# EAGLE design M222B (EAGLE 6.6.0)
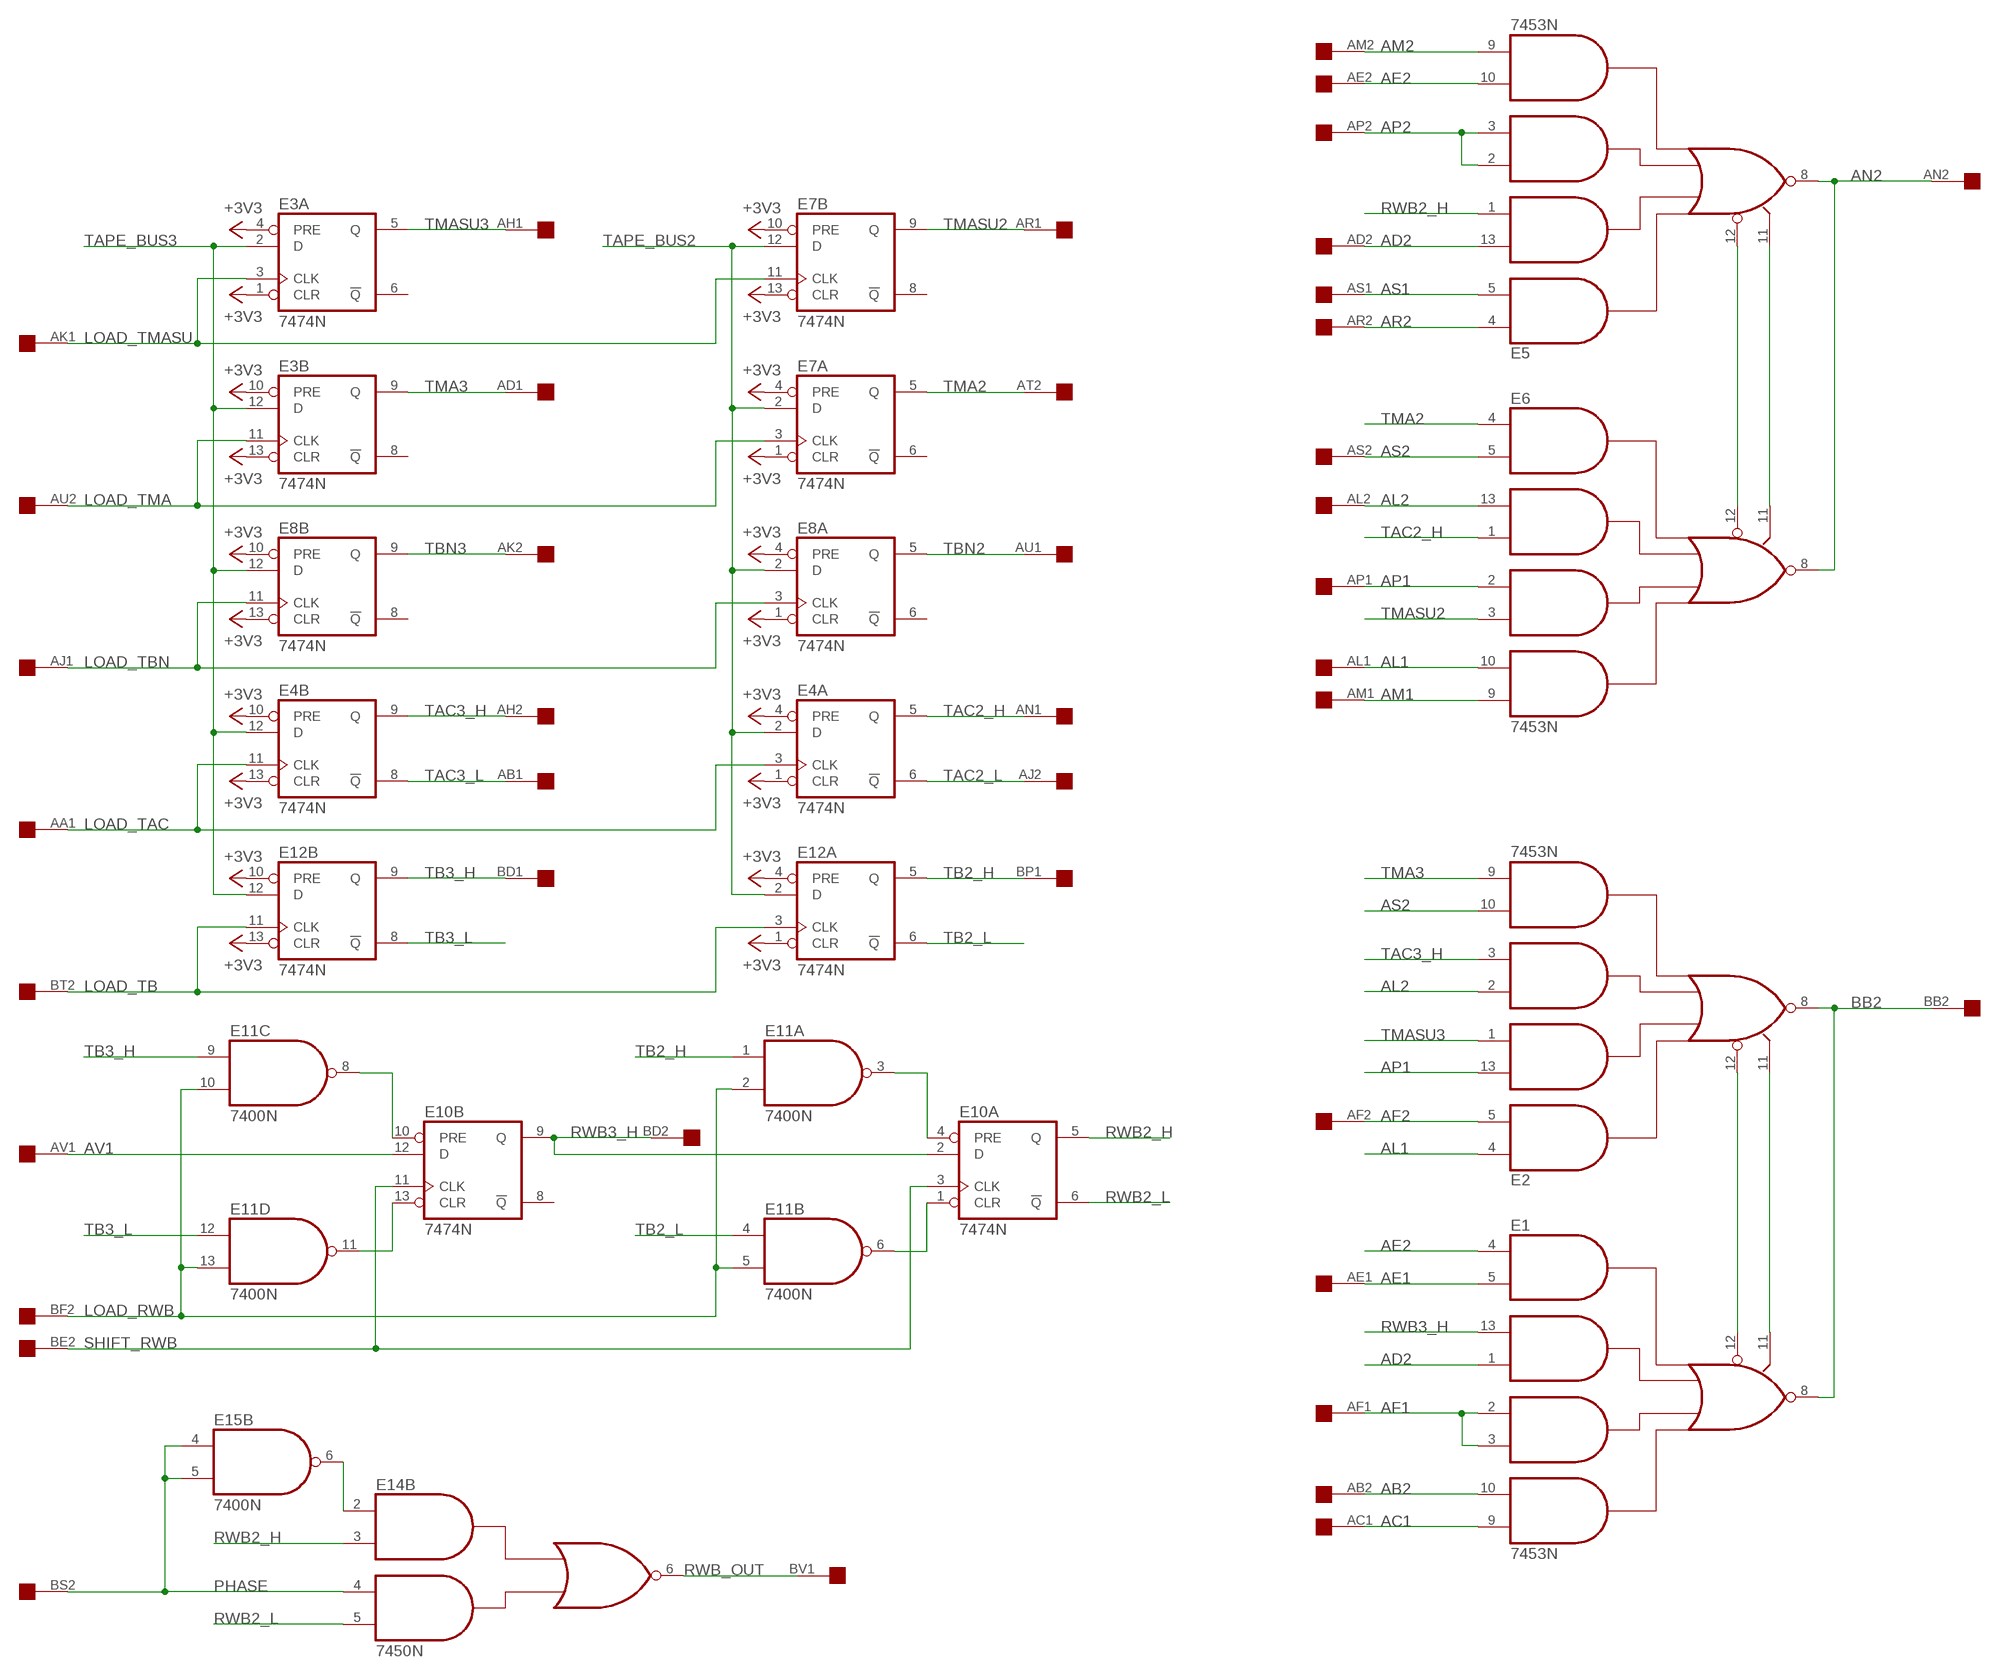
[diagram p0: schematic, sheet 1, part 1 of 2]
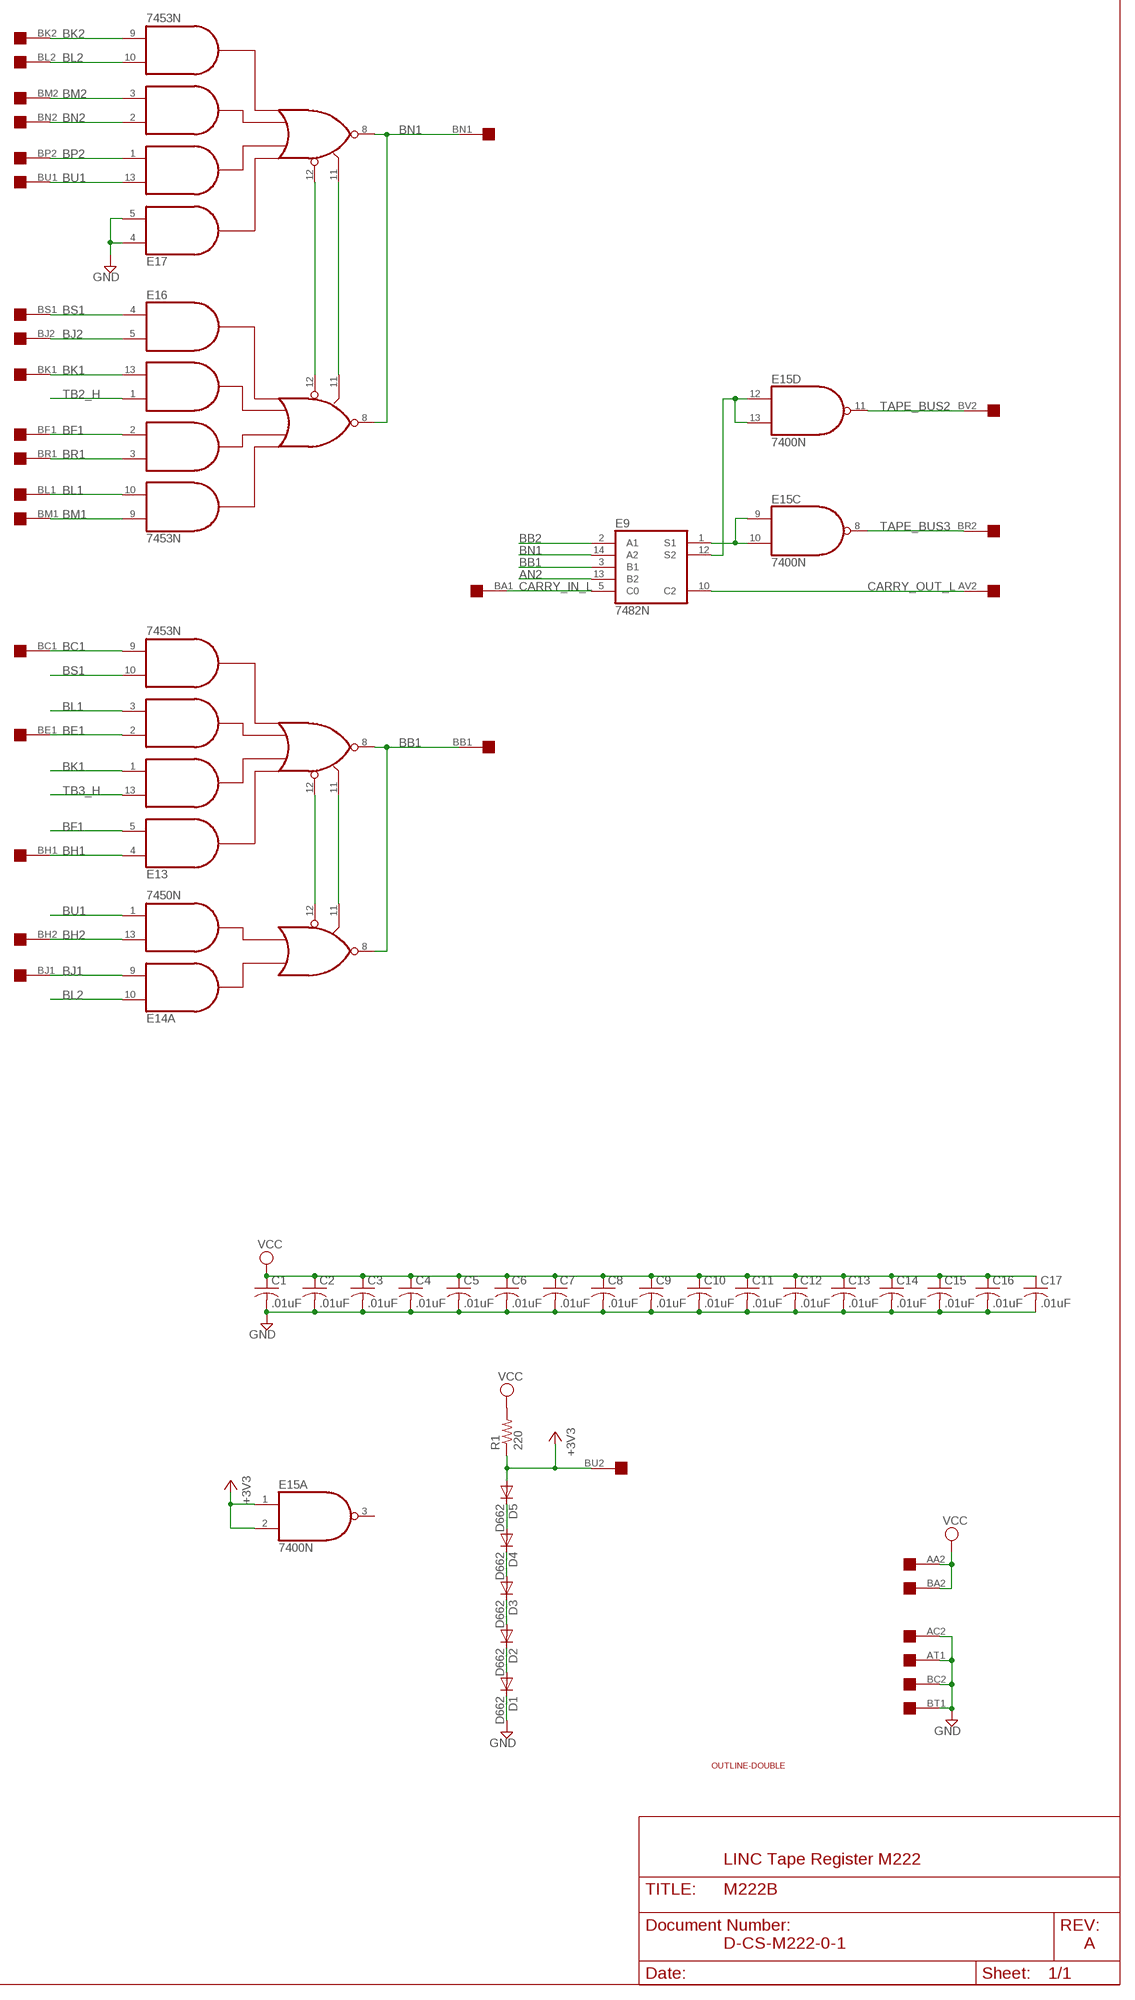
[diagram p1: schematic, sheet 1, part 2 of 2]

## Parts
C1  .01uF  C-US050-025X075  [C050-025X075]
C2  .01uF  C-US050-025X075  [C050-025X075]
C3  .01uF  C-US050-025X075  [C050-025X075]
C4  .01uF  C-US050-025X075  [C050-025X075]
C5  .01uF  C-US050-025X075  [C050-025X075]
C6  .01uF  C-US050-025X075  [C050-025X075]
C7  .01uF  C-US050-025X075  [C050-025X075]
C8  .01uF  C-US050-025X075  [C050-025X075]
C9  .01uF  C-US050-025X075  [C050-025X075]
C10  .01uF  C-US050-025X075  [C050-025X075]
C11  .01uF  C-US050-025X075  [C050-025X075]
C12  .01uF  C-US050-025X075  [C050-025X075]
C13  .01uF  C-US050-025X075  [C050-025X075]
C14  .01uF  C-US050-025X075  [C050-025X075]
C15  .01uF  C-US050-025X075  [C050-025X075]
C16  .01uF  C-US050-025X075  [C050-025X075]
C17  .01uF  C-US050-025X075  [C050-025X075]
D1  D662  1N4148DO35-10  [DO35-10]
D2  D662  1N4148DO35-10  [DO35-10]
D3  D662  1N4148DO35-10  [DO35-10]
D4  D662  1N4148DO35-10  [DO35-10]
D5  D662  1N4148DO35-10  [DO35-10]
E1  7453N  [DIL14]
E2  7453N  [DIL14]
E3  7474N  74S74N  [DIL14]
E4  7474N  74S74N  [DIL14]
E5  7453N  [DIL14]
E6  7453N  [DIL14]
E7  7474N  74S74N  [DIL14]
E8  7474N  74S74N  [DIL14]
E9  7482N  [DIL14]
E10  7474N  74S74N  [DIL14]
E11  7400N  [DIL14]
E12  7474N  74S74N  [DIL14]
E13  7453N  [DIL14]
E14  7450N  [DIL14]
E15  7400N  [DIL14]
E16  7453N  [DIL14]
E17  7453N  [DIL14]
R1  220  R-US_0207/10  [0207/10]
U$1  DOUBLE  [EDGE-CON4]
U$2  OUTLINE-DOUBLE  [DOUBLE]

## Nets
+3V3 [Supply]: D5.A E3.1(A:CLR) E3.4(A:PRE) E3.10(B:PRE) E3.13(B:CLR) E4.1(A:CLR) E4.4(A:PRE) E4.10(B:PRE) E4.13(B:CLR) E7.1(A:CLR) E7.4(A:PRE) E7.10(B:PRE) E7.13(B:CLR) E8.1(A:CLR) E8.4(A:PRE) E8.10(B:PRE) E8.13(B:CLR) E12.1(A:CLR) E12.4(A:PRE) E12.10(B:PRE) E12.13(B:CLR) E15.1(A:I0) E15.2(A:I1) R1.1 U$1.BU2
AB2: E1.10(I7) U$1.AB2
AC1: E1.9(I8) U$1.AC1
AD2: E1.1(I4) E5.13(I3) U$1.AD2
AE1: E1.5(I2) U$1.AE1
AE2: E1.4(I1) E5.10(I7) U$1.AE2
AF1: E1.2(I5) E1.3(I6) U$1.AF1
AF2: E2.5(I2) U$1.AF2
AL1: E2.4(I1) E6.10(I7) U$1.AL1
AL2: E2.2(I5) E6.13(I3) U$1.AL2
AM1: E6.9(I8) U$1.AM1
AM2: E5.9(I8) U$1.AM2
AN2: E5.8(O) E6.8(O) E9.13(B2) U$1.AN2
AP1: E2.13(I3) E6.2(I5) U$1.AP1
AP2: E5.2(I5) E5.3(I6) U$1.AP2
AR2: E5.4(I1) U$1.AR2
AS1: E5.5(I2) U$1.AS1
AS2: E2.10(I7) E6.5(I2) U$1.AS2
AV1: E10.12(B:D) U$1.AV1
BB1: E9.3(B1) E13.8(O) E14.8(A:O) U$1.BB1
BB2: E1.8(O) E2.8(O) E9.2(A1) U$1.BB2
BC1: E13.9(I8) U$1.BC1
BE1: E13.2(I5) U$1.BE1
BF1: E13.5(I2) E16.2(I5) U$1.BF1
BH1: E13.4(I1) U$1.BH1
BH2: E14.13(A:I3) U$1.BH2
BJ1: E14.9(A:I2) U$1.BJ1
BJ2: E16.5(I2) U$1.BJ2
BK1: E13.1(I4) E16.13(I3) U$1.BK1
BK2: E17.9(I8) U$1.BK2
BL1: E13.3(I6) E16.10(I7) U$1.BL1
BL2: E14.10(A:I1) E17.10(I7) U$1.BL2
BM1: E16.9(I8) U$1.BM1
BM2: E17.3(I6) U$1.BM2
BN1: E9.14(A2) E16.8(O) E17.8(O) U$1.BN1
BN2: E17.2(I5) U$1.BN2
BP2: E17.1(I4) U$1.BP2
BR1: E16.3(I6) U$1.BR1
BS1: E13.10(I7) E16.4(I1) U$1.BS1
BU1: E14.1(A:I4) E17.13(I3) U$1.BU1
CARRY_IN_L: E9.5(C0) U$1.BA1
CARRY_OUT_L: E9.10(C2) U$1.AV2
GND [Supply]: C1.2 C2.2 C3.2 C4.2 C5.2 C6.2 C7.2 C8.2 C9.2 C10.2 C11.2 C12.2 C13.2 C14.2 C15.2 C16.2 C17.2 D1.C E17.4(I1) E17.5(I2) U$1.AC2 U$1.AT1 U$1.BC2 U$1.BT1
LOAD_RWB: E11.2(A:I1) E11.5(B:I1) E11.10(C:I1) E11.13(D:I1) U$1.BF2
LOAD_TAC: E4.3(A:CLK) E4.11(B:CLK) U$1.AA1
LOAD_TB: E12.3(A:CLK) E12.11(B:CLK) U$1.BT2
LOAD_TBN: E8.3(A:CLK) E8.11(B:CLK) U$1.AJ1
LOAD_TMA: E3.11(B:CLK) E7.3(A:CLK) U$1.AU2
LOAD_TMASU: E3.3(A:CLK) E7.11(B:CLK) U$1.AK1
N$1: E9.1(S1) E15.9(C:I0) E15.10(C:I1)
N$2: E9.12(S2) E15.12(D:I0) E15.13(D:I1)
N$3: E1.12(I9) E2.12(I9)
N$4: E1.11(I10) E2.11(I10)
N$5: E5.11(I10) E6.11(I10)
N$6: E5.12(I9) E6.12(I9)
N$7: E10.13(B:CLR) E11.11(D:O)
N$8: E10.10(B:PRE) E11.8(C:O)
N$9: E16.12(I9) E17.12(I9)
N$10: E16.11(I10) E17.11(I10)
N$11: D4.A D5.C
N$12: E13.12(I9) E14.12(A:I5)
N$13: E13.11(I10) E14.11(A:I6)
N$14: D1.A D2.C
N$15: E14.2(B:I1) E15.6(B:O)
N$16: E10.4(A:PRE) E11.3(A:O)
N$17: E10.1(A:CLR) E11.6(B:O)
N$18: D2.A D3.C
N$19: D3.A D4.C
PHASE: E14.4(B:I3) E15.4(B:I0) E15.5(B:I1) U$1.BS2
RWB2_H: E5.1(I4) E10.5(A:Q) E14.3(B:I2)
RWB2_L: E10.6(A:!Q) E14.5(B:I4)
RWB3_H: E1.13(I3) E10.2(A:D) E10.9(B:Q) U$1.BD2
RWB_OUT: E14.6(B:O) U$1.BV1
SHIFT_RWB: E10.3(A:CLK) E10.11(B:CLK) U$1.BE2
TAC2_H: E4.5(A:Q) E6.1(I4) U$1.AN1
TAC2_L: E4.6(A:!Q) U$1.AJ2
TAC3_H: E2.3(I6) E4.9(B:Q) U$1.AH2
TAC3_L: E4.8(B:!Q) U$1.AB1
TAPE_BUS2: E4.2(A:D) E7.2(A:D) E7.12(B:D) E8.2(A:D) E12.2(A:D) E15.11(D:O) U$1.BV2
TAPE_BUS3: E3.2(A:D) E3.12(B:D) E4.12(B:D) E8.12(B:D) E12.12(B:D) E15.8(C:O) U$1.BR2
TB2_H: E11.1(A:I0) E12.5(A:Q) E16.1(I4) U$1.BP1
TB2_L: E11.4(B:I0) E12.6(A:!Q)
TB3_H: E11.9(C:I0) E12.9(B:Q) E13.13(I3) U$1.BD1
TB3_L: E11.12(D:I0) E12.8(B:!Q)
TBN2: E8.5(A:Q) U$1.AU1
TBN3: E8.9(B:Q) U$1.AK2
TMA2: E6.4(I1) E7.5(A:Q) U$1.AT2
TMA3: E2.9(I8) E3.9(B:Q) U$1.AD1
TMASU2: E6.3(I6) E7.9(B:Q) U$1.AR1
TMASU3: E2.1(I4) E3.5(A:Q) U$1.AH1
VCC [Supply]: C1.1 C2.1 C3.1 C4.1 C5.1 C6.1 C7.1 C8.1 C9.1 C10.1 C11.1 C12.1 C13.1 C14.1 C15.1 C16.1 C17.1 R1.2 U$1.AA2 U$1.BA2
Unconnected: E1.6(SPARE) E2.6(SPARE) E3.6(A:!Q) E3.8(B:!Q) E5.6(SPARE) E6.6(SPARE) E7.6(A:!Q) E7.8(B:!Q) E8.6(A:!Q) E8.8(B:!Q) E9.6 E9.7 E9.8 E9.9 E10.8(B:!Q) E13.6(SPARE) E15.3(A:O) E16.6(SPARE) E17.6(SPARE)

## Notes on the sheet
- LINC Tape Register M222
- D-CS-M222-0-1 | A

## Power pins joined to a net without a drawn wire
GND: E1.7(GND) E2.7(GND) E3.7(P:GND) E4.7(P:GND) E5.7(GND) E6.7(GND) E7.7(P:GND) E8.7(P:GND) E9.11(GND) E10.7(P:GND) E11.7(P:GND) E12.7(P:GND) E13.7(GND) E14.7(P:GND) E15.7(P:GND) E16.7(GND) E17.7(GND)
VCC: E1.14(VCC) E2.14(VCC) E3.14(P:VCC) E4.14(P:VCC) E5.14(VCC) E6.14(VCC) E7.14(P:VCC) E8.14(P:VCC) E9.4(VCC) E10.14(P:VCC) E11.14(P:VCC) E12.14(P:VCC) E13.14(VCC) E14.14(P:VCC) E15.14(P:VCC) E16.14(VCC) E17.14(VCC)

## Library data of the parts
C1-C17 = rcl:C-US: CAPACITOR, American symbol
D1-D5 = diode:1N4148: DIODE high speed (Philips)
E1 E2 E5 E6 E13 E16 E17 = dec-con:74*53: 4-2-3-2 input AND OR INVERTER gates
E3 E4 E7 E8 E10 E12 = 74xx-us:74*74: Dual D type positive edge triggered FLIP FLOP, preset and clear
E9 = dec-con:74*82: 2-bit binary full ADDER Has the wrong GND pin in other libraries.
E11 E15 = 74xx-us:74*00: Quad 2-input NAND gate
E14 = dec-con:74*50: 4-2-3-2 input AND OR INVERTER gates
R1 = rcl:R-US_: RESISTOR, American symbol
U$1 = dec-con:DOUBLE: Double-Height DEC board
U$2 = dec-con:OUTLINE-*: Board outlines for DEC boards.

## Net classes
1 Supply: width 0.813 mm

## Board
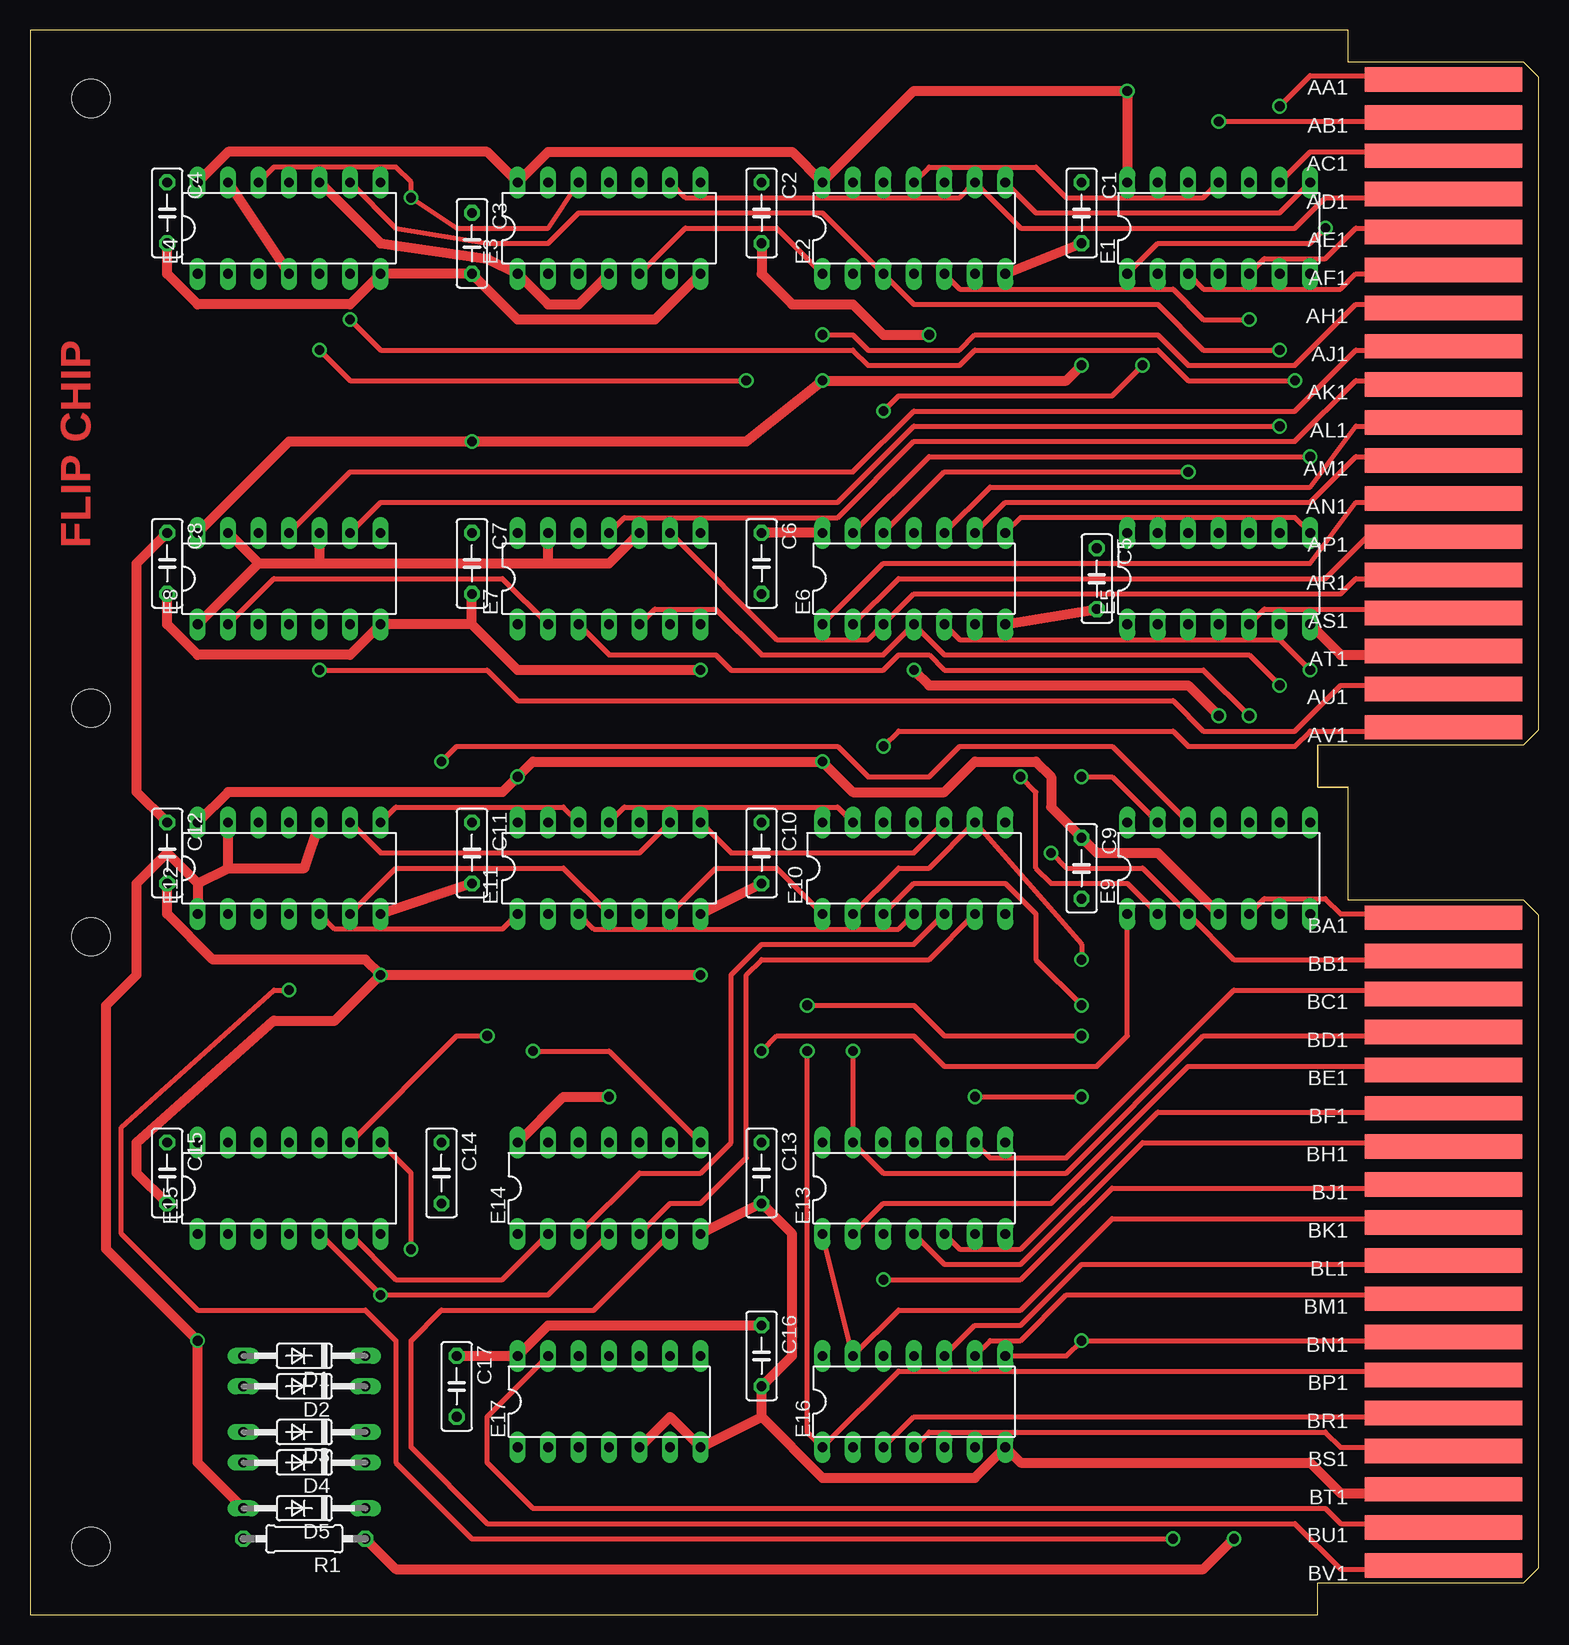
[diagram p2: board, top side]
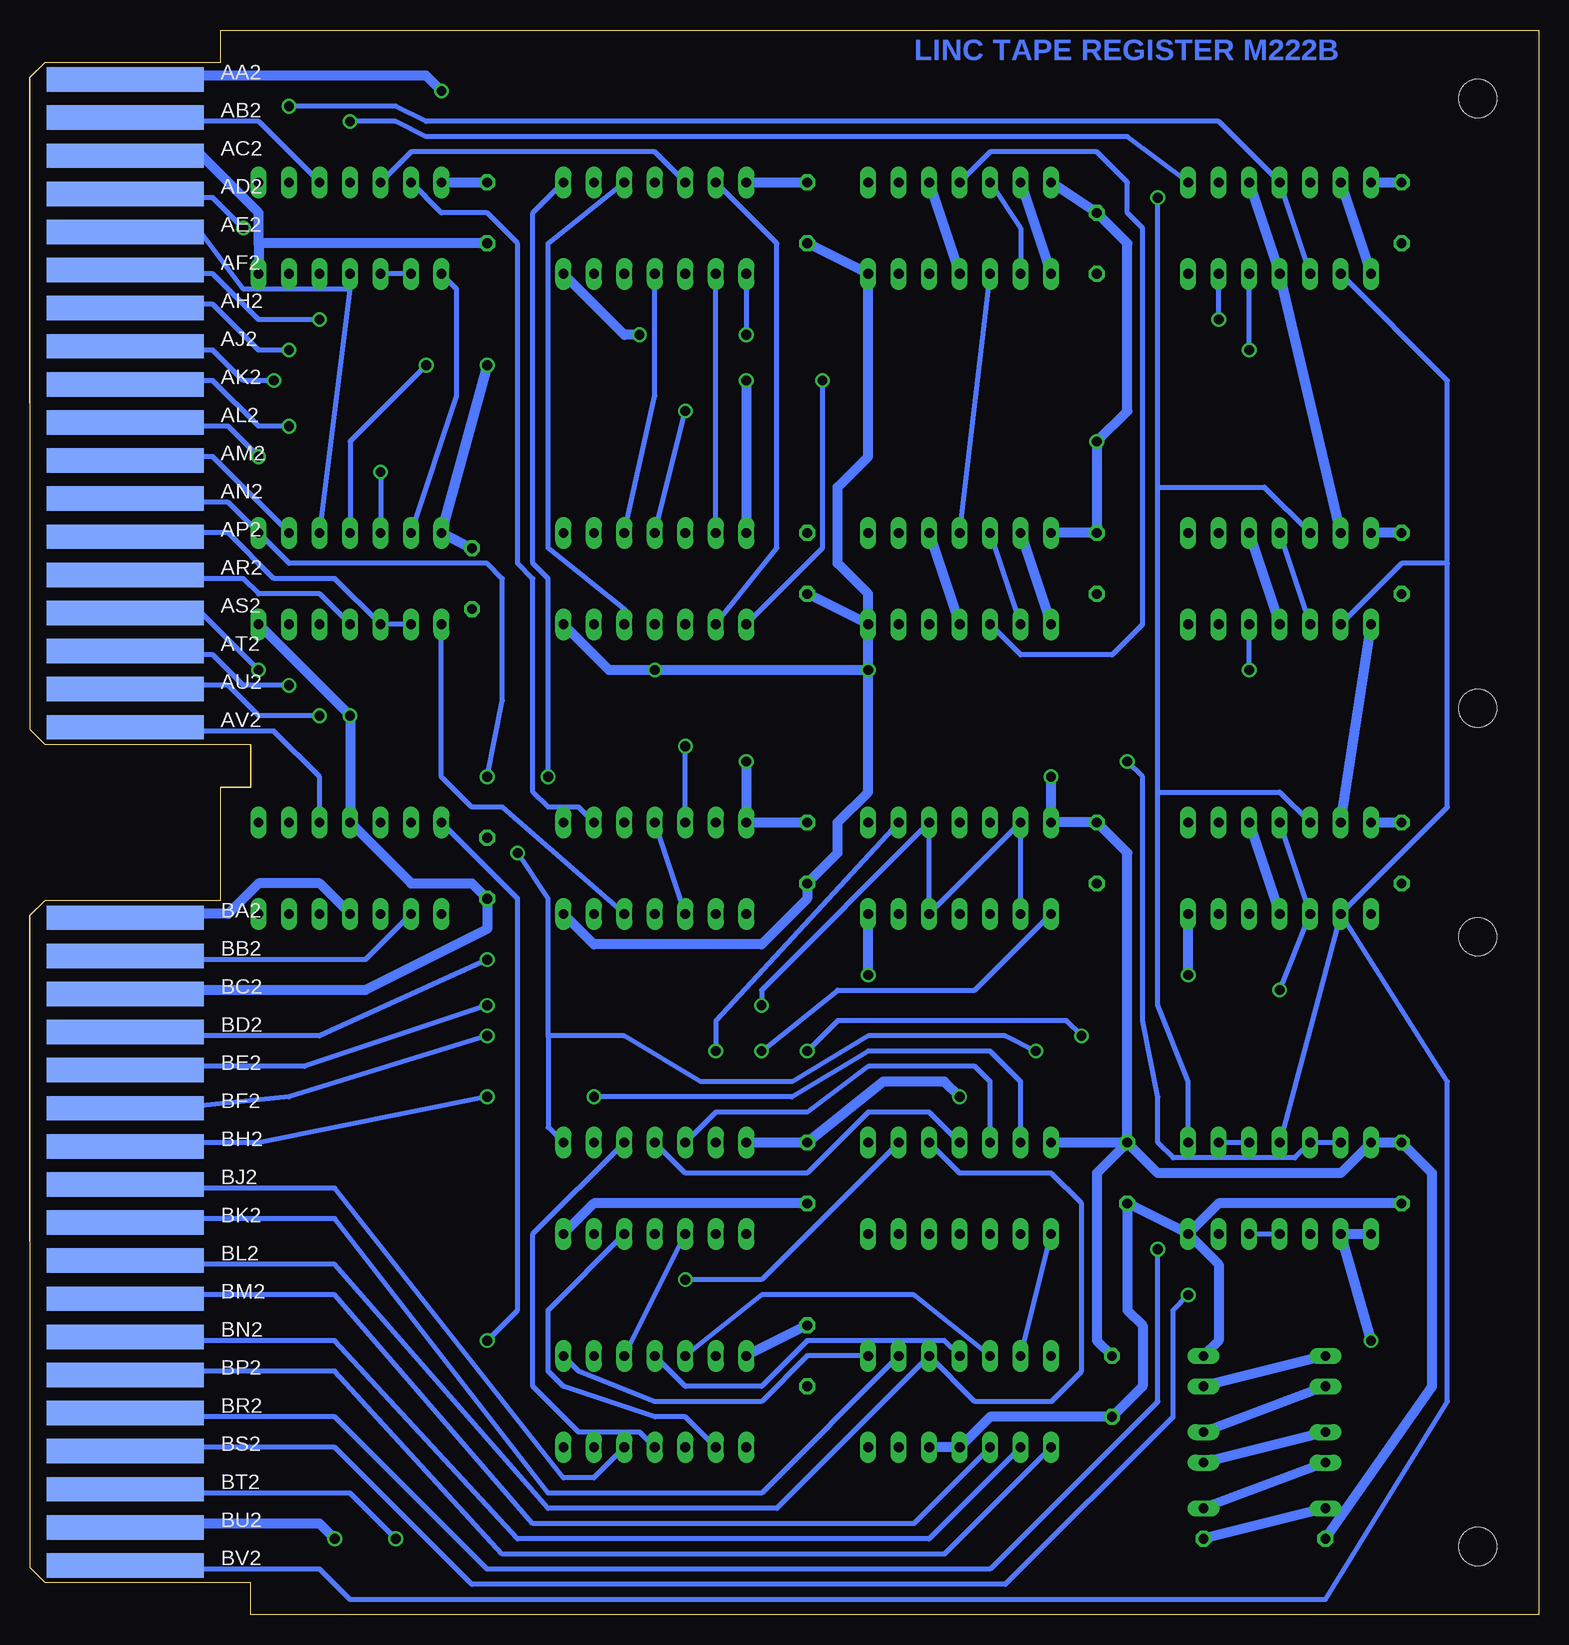
[diagram p3: board, bottom side, seen from below]

Size 125.73 x 132.08 mm. Coordinates in mm from the lower left corner, seen from the top.
Copper layers (1+16): Top 0.035mm / dielectric 1.5mm / Bottom 0.035mm
Design rules "16mils": minimum track width 16mil, minimum drill 32mil, track to track 15mil, track to pad 10mil, pad to pad 10mil, via to via 10mil, smd to smd 10mil, copper to edge 13mil, drill to drill 10mil, minimum pad ring 10mil, minimum via ring 8mil, stop-mask expansion 0mil, vias tented up to drill 0mil, thermal gap 10mil

### Footprints (pad centres in the part's own frame; a part is rotated, then mirrored left to right if it is on the bottom)
C050-025X075 = drill 0.813 octagon: 1 -2.54,0; 2 2.54,0
DO35-10 = drill 0.813 long: A 5.08,0; C -5.08,0
DIL14 = drill 0.813 long: 1 -7.62,-3.81; 2 -5.08,-3.81; 3 -2.54,-3.81; 4 0,-3.81; 5 2.54,-3.81; 6 5.08,-3.81; 7 7.62,-3.81; 8 7.62,3.81; 9 5.08,3.81; 10 2.54,3.81; 11 0,3.81; 12 -2.54,3.81; 13 -5.08,3.81; 14 -7.62,3.81
0207/10 = drill 0.813 octagon: 1 -5.08,0; 2 5.08,0
EDGE-CON4 = smd 13.106 x 2.032: AA1 7.938,4.128; AB1 7.938,7.303; AC1 7.938,10.477; AD1 7.938,13.652; AE1 7.938,16.828; AF1 7.938,20.003; AH1 7.938,23.177; AJ1 7.938,26.352; AK1 7.938,29.527; AL1 7.938,32.703; AM1 7.938,35.877; AN1 7.938,39.053; AP1 7.938,42.227; AR1 7.938,45.403; AS1 7.938,48.578; AT1 7.938,51.752; AU1 7.938,54.928; AV1 7.938,58.102; BA1 7.938,73.978; BB1 7.938,77.153; BC1 7.938,80.328; BD1 7.938,83.502; BE1 7.938,86.677; BF1 7.938,89.853; BH1 7.938,93.028; BJ1 7.938,96.203; BK1 7.938,99.377; BL1 7.938,102.552; BM1 7.938,105.728; BN1 7.938,108.903; BP1 7.938,112.078; BR1 7.938,115.252; BS1 7.938,118.427; BT1 7.938,121.603; BU1 7.938,124.778; BV1 7.938,127.953 | smd 13.106 x 2.032 bottom: AA2 7.938,4.128; AB2 7.938,7.303; AC2 7.938,10.477; AD2 7.938,13.652; AE2 7.938,16.828; AF2 7.938,20.003; AH2 7.938,23.177; AJ2 7.938,26.352; AK2 7.938,29.527; AL2 7.938,32.703; AM2 7.938,35.877; AN2 7.938,39.053; AP2 7.938,42.227; AR2 7.938,45.403; AS2 7.938,48.578; AT2 7.938,51.752; AU2 7.938,54.928; AV2 7.938,58.102; BA2 7.938,73.978; BB2 7.938,77.153; BC2 7.938,80.328; BD2 7.938,83.502; BE2 7.938,86.677; BF2 7.938,89.853; BH2 7.938,93.028; BJ2 7.938,96.203; BK2 7.938,99.377; BL2 7.938,102.552; BM2 7.938,105.728; BN2 7.938,108.903; BP2 7.938,112.078; BR2 7.938,115.252; BS2 7.938,118.427; BT2 7.938,121.603; BU2 7.938,124.778; BV2 7.938,127.953
DOUBLE = hole 3.175: 120.65,56.515; 120.65,5.715; 120.65,75.565; 120.65,126.365

### Placement (x,y rotation side)
C1  87.63,116.84 270 top
C2  60.96,116.84 270 top
C3  36.83,114.3 270 top
C4  11.43,116.84 270 top
C5  88.9,86.36 270 top
C6  60.96,87.63 270 top
C7  36.83,87.63 270 top
C8  11.43,87.63 270 top
C9  87.63,62.23 270 top
C10  60.96,63.5 270 top
C11  36.83,63.5 270 top
C12  11.43,63.5 270 top
C13  60.96,36.83 270 top
C14  34.29,36.83 270 top
C15  11.43,36.83 270 top
C16  60.96,21.59 270 top
C17  35.56,19.05 270 top
D1  22.86,21.59 180 top
D2  22.86,19.05 180 top
D3  22.86,15.24 180 top
D4  22.86,12.7 180 top
D5  22.86,8.89 180 top
E1  99.06,115.57 0 top
E2  73.66,115.57 0 top
E3  48.26,115.57 0 top
E4  21.59,115.57 0 top
E5  99.06,86.36 0 top
E6  73.66,86.36 0 top
E7  48.26,86.36 0 top
E8  21.59,86.36 0 top
E9  99.06,62.23 0 top
E10  73.66,62.23 0 top
E11  48.26,62.23 0 top
E12  21.59,62.23 0 top
E13  73.66,35.56 0 top
E14  48.26,35.56 0 top
E15  21.59,35.56 0 top
E16  73.66,17.78 0 top
E17  48.26,17.78 0 top
R1  22.86,6.35 180 top
U$1  125.73,132.08 180 top
U$2  125.73,132.08 180 top
U$4  [FLIPCHIP]  0,69.85 0 top

### Tracks (layer width: path | path; a pad name or v marks a point on that pad's centre or on a via)
+3V3  (via drill 0.81)
  Top 0.813: D5.A 13.97,12.7 v13.97,22.86 6.35,30.48 6.35,50.8 8.89,53.34 8.89,60.96 11.43,63.5 13.97,60.96 | R1.1 30.48,3.81 97.79,3.81 v100.33,6.35 | 13.97,60.96 E12.1 | E12.10 22.86,62.23 16.51,62.23 | 16.51,62.23 E12.13 | 13.97,60.96 16.51,62.23 | E7.10 48.26,87.63 43.18,87.63 | 43.18,87.63 E7.13 | 19.05,87.63 E8.13 | 19.05,87.63 24.13,87.63 | E8.1 19.05,87.63 | 24.13,87.63 E8.10 | 24.13,87.63 43.18,87.63 | E3.4 45.72,109.22 43.18,109.22 E3.1 38.1,113.03 29.21,114.3 E4.10 | E4.4 E4.13
  Bottom 0.813: U$1.BU2 117.2,7.26 116.84,7.62 101.6,7.62 v100.33,6.35 | D5.A R1.1 | v13.97,22.86 E15.2 E15.1 | E12.13 E8.1 | E8.10 E8.4 | E7.10 E7.4 | E12.10 E12.4 | E4.10 E4.4 E8.13 | E7.13 E7.1 | E4.13 E4.1 | E3.1 E3.13 | E3.4 E3.10
AB2
  Bottom 0.406: U$1.AB2 116.84,124.46 106.68,124.46 E1.10
AC1
  Top 0.406: U$1.AC1 116.84,121.92 106.68,121.92 E1.9
AD2  (via drill 0.81)
  Top 0.406: E1.1 93.98,114.3 106.68,114.3 v107.95,115.57
  Bottom 0.406: E5.13 90.17,101.6 90.17,110.49 E1.1 | U$1.AD2 116.84,118.11 110.49,118.11 v107.95,115.57
AE1
  Top 0.406: U$1.AE1 116.84,115.57 110.49,115.57 107.95,113.03 102.87,113.03 E1.5
AE2
  Bottom 0.406: E5.10 99.06,110.49 | 99.06,110.49 E1.4 | 99.06,110.49 107.95,110.49 111.76,115.57 116.84,115.57 U$1.AE2
AF1
  Top 0.406: E1.3 97.79,110.49 109.22,110.49 110.49,111.76 116.84,111.76 U$1.AF1
  Bottom 0.406: E1.2 E1.3
AF2  (via drill 0.81)
  Top 0.406: E2.5 77.47,110.49 95.25,110.49 97.79,107.95 v101.6,107.95
  Bottom 0.406: v101.6,107.95 106.68,107.95 110.49,111.76 116.84,111.76 U$1.AF2
AL1
  Top 0.406: E6.10 80.01,93.98 106.68,93.98 110.49,99.06 116.84,99.06 U$1.AL1
  Bottom 0.406: E2.4 73.66,101.6 E6.10
AL2  (via drill 0.81)
  Top 0.406: E6.13 74.93,96.52 v106.68,96.52
  Bottom 0.406: E6.13 E2.2 | U$1.AL2 116.84,99.06 109.22,99.06 v106.68,96.52
AM1
  Top 0.406: E6.9 81.28,92.71 106.68,92.71 110.49,96.52 116.84,96.52 U$1.AM1
AM2
  Bottom 0.406: U$1.AM2 117.71,96.52 110.49,96.52 E5.9
AN2  (via drill 0.81)
  Top 0.406: E9.13 90.17,69.85 v87.63,69.85 | E6.8 82.55,91.44 105.41,91.44 E5.8
  Bottom 0.406: U$1.AN2 117.17,93.04 116.84,92.71 109.22,92.71 E5.8 104.14,87.63 87.63,87.63 86.36,86.36 86.36,76.2 v87.63,69.85
AP1
  Top 0.406: E6.2 72.39,86.36 107.95,86.36 111.76,90.17 116.84,90.17 U$1.AP1
  Bottom 0.406: E2.13 63.5,114.3 63.5,88.9 E6.2
AP2
  Bottom 0.406: U$1.AP2 117.17,89.84 116.84,90.17 109.22,90.17 105.41,86.36 100.33,86.36 E5.3 E5.2
AR2
  Bottom 0.406: U$1.AR2 117.17,86.69 116.84,86.36 107.95,86.36 106.68,85.09 101.6,85.09 E5.4
AS1
  Top 0.406: U$1.AS1 116.84,83.82 102.87,83.82 E5.5
AS2  (via drill 0.81)
  Top 0.406: E6.5 77.47,81.28 104.14,81.28 v106.68,78.74
  Bottom 0.406: E6.5 76.2,83.82 82.55,88.9 82.55,114.3 E2.10 | U$1.AS2 116.84,83.82 111.76,83.82 v106.68,78.74
AV1  (via drill 0.81)
  Top 0.406: U$1.AV1 116.84,73.66 106.68,73.66 105.41,72.39 96.52,72.39 95.25,73.66 72.39,73.66 v71.12,72.39
  Bottom 0.406: E10.12 v71.12,72.39
BB1  (via drill 0.81)
  Top 0.406: U$1.BB1 117.15,54.92 116.84,54.61 100.33,54.61 E9.3 92.71,62.23 86.36,62.23 v85.09,63.5 | E14.8 48.26,46.99 v41.91,46.99
  Bottom 0.406: E13.8 82.55,40.64 82.55,48.26 | 82.55,48.26 82.55,59.69 v85.09,63.5 | 82.55,48.26 76.2,48.26 69.85,44.45 62.23,44.45 55.88,48.26 44.45,48.26 v41.91,46.99
BB2  (via drill 0.81)
  Top 0.406: E9.2 91.44,60.96 85.09,60.96 83.82,62.23 83.82,68.58 v82.55,69.85 | E2.8 83.82,116.84 104.14,116.84 E1.8
  Bottom 0.406: U$1.BB2 117.13,54.9 116.84,54.61 97.79,54.61 E9.2 | v82.55,69.85 82.55,86.36 83.82,87.63 83.82,116.84 E2.8
BC1
  Top 0.406: E13.9 80.01,38.1 86.36,38.1 100.33,52.07 116.84,52.07 U$1.BC1
BE1
  Top 0.406: E13.2 71.12,34.29 85.09,34.29 96.52,45.72 116.84,45.72 U$1.BE1
BF1
  Top 0.406: E13.5 77.47,30.48 82.55,30.48 93.98,41.91 116.84,41.91 117.12,42.19 U$1.BF1
  Bottom 0.406: E16.2 71.12,16.51 73.66,16.51 81.28,19.05 82.55,20.32 82.55,25.4 E13.5
BH1
  Top 0.406: E13.4 76.2,29.21 82.55,29.21 92.71,39.37 116.84,39.37 117.17,39.04 U$1.BH1
BH2  (via drill 0.81)
  Top 0.406: v78.74,43.18 v87.63,43.18
  Bottom 0.406: U$1.BH2 117.17,39.04 116.84,39.37 106.68,39.37 v87.63,43.18 | E14.13 43.18,44.45 45.72,46.99 55.88,46.99 62.23,43.18 v78.74,43.18
BJ1  (via drill 0.81)
  Top 0.406: U$1.BJ1 117.17,35.89 116.84,35.56 90.17,35.56 82.55,27.94 v71.12,27.94
  Bottom 0.406: v71.12,27.94 64.77,27.94 E14.9
BJ2
  Bottom 0.406: U$1.BJ2 117.17,35.89 116.84,35.56 100.33,35.56 81.28,11.43 78.74,11.43 E16.5
BK1
  Top 0.406: U$1.BK1 117.14,32.72 116.84,33.02 90.17,33.02 82.55,25.4 72.39,25.4 E16.13 E13.1
BK2
  Bottom 0.406: U$1.BK2 117.14,32.72 116.84,33.02 100.33,33.02 82.55,10.16 64.77,10.16 E17.9
BL1
  Top 0.406: U$1.BL1 117.17,29.54 116.84,29.21 87.63,29.21 82.55,24.13 78.74,24.13 E16.10
  Bottom 0.406: E16.10 E13.3
BL2
  Bottom 0.406: U$1.BL2 117.17,29.54 116.84,29.21 100.33,29.21 82.55,8.89 63.5,8.89 E17.10 46.99,17.78 40.64,17.78 38.1,20.32 38.1,34.29 40.64,36.83 48.26,36.83 E14.10
BM1
  Top 0.406: U$1.BM1 117.17,26.34 116.84,26.67 86.36,26.67 82.55,22.86 80.01,22.86 E16.9
BM2
  Bottom 0.406: E17.3 52.07,7.62 83.82,7.62 100.33,26.67 116.84,26.67 117.17,26.34 U$1.BM2
BN1  (via drill 0.81)
  Top 0.406: E16.8 86.36,21.59 v87.63,22.86 116.84,22.86 117.17,23.19 U$1.BN1
  Bottom 0.406: E16.8 80.01,20.32 73.66,17.78 64.77,17.78 60.96,21.59 E17.8 | v87.63,22.86 85.09,25.4 85.09,59.69 E9.14
BN2
  Bottom 0.406: U$1.BN2 117.17,23.19 116.84,22.86 100.33,22.86 85.09,6.35 50.8,6.35 E17.2
BP2
  Bottom 0.406: U$1.BP2 117.17,19.99 116.84,20.32 100.33,20.32 86.36,5.08 49.53,5.08 E17.1
BR1
  Top 0.406: U$1.BR1 117.17,16.84 116.84,16.51 73.66,16.51 E16.3
BS1
  Top 0.406: U$1.BS1 117.14,13.66 116.84,13.97 109.22,13.97 107.95,15.24 74.93,15.24 E16.4
  Bottom 0.406: E16.4 74.93,15.24 80.01,15.24 83.82,19.05 83.82,31.75 E13.10
BU1
  Top 0.406: U$1.BU1 117.17,7.29 116.84,7.62 109.22,7.62 107.95,8.89 41.91,8.89 38.1,12.7 38.1,16.51 E17.13
  Bottom 0.406: E17.13 E14.1
CARRY_IN_L
  Top 0.406: U$1.BA1 117.24,58.02 116.84,58.42 109.22,58.42 107.95,59.69 102.87,59.69 E9.5
CARRY_OUT_L
  Bottom 0.406: U$1.AV2 116.84,73.66 105.41,73.66 101.6,69.85 E9.10
GND  (via drill 0.81)
  Top 0.813: 60.96,16.51 E17.7 53.34,16.51 E17.5 | 60.96,16.51 66.04,11.43 78.74,11.43 E16.7 82.55,12.7 106.68,12.7 109.22,10.16 116.84,10.16 117.17,10.49 U$1.BT1 | 60.96,16.51 C16.2 63.5,21.59 63.5,31.75 C13.2 E14.7 | E11.7 C10.2 | E3.7 52.07,107.95 40.64,107.95 C3.2 E4.7 26.67,109.22 13.97,109.22 11.43,111.76 C4.2 | C2.2 60.96,111.76 63.5,109.22 68.58,109.22 71.12,106.68 v74.93,106.68 | E2.7 C1.2 | v73.66,78.74 74.93,77.47 96.52,77.47 v99.06,74.93 | U$1.AT1 116.84,80.01 109.22,80.01 E5.7 | v29.21,53.34 27.94,54.61 15.24,54.61 11.43,58.42 C12.2 | C15.2 8.89,36.83 8.89,39.37 20.32,49.53 25.4,49.53 v29.21,53.34 | v55.88,78.74 40.64,78.74 36.83,82.55 | E12.7 C11.2 | v29.21,53.34 v55.88,53.34 | E6.7 C5.2 | C8.2 11.43,82.55 13.97,80.01 26.67,80.01 E8.7 36.83,82.55 | 36.83,82.55 C7.2
  Bottom 0.813: D1.C 26.67,22.86 26.67,29.21 E15.7 | E15.7 C14.2 34.29,25.4 33.02,24.13 33.02,19.05 C17.2 45.72,16.51 E17.4 E17.5 | C15.2 26.67,34.29 E15.7 | C2.2 E3.7 55.88,96.52 58.42,93.98 58.42,87.63 55.88,85.09 E7.7 | v74.93,106.68 76.2,106.68 E2.7 | C1.2 106.68,114.3 | E13.7 78.74,34.29 C13.2 | E10.7 78.74,55.88 64.77,55.88 60.96,59.69 C10.2 58.42,63.5 58.42,66.04 55.88,68.58 v55.88,78.74 | v55.88,53.34 E11.7 | v29.21,53.34 E12.7 | E5.7 v99.06,74.93 E9.11 93.98,60.96 88.9,60.96 C9.2 87.63,57.15 97.79,52.07 116.84,52.07 U$1.BC2 | v55.88,78.74 E7.7 | E7.7 C6.2 | v55.88,78.74 v73.66,78.74 77.47,78.74 E6.7 | U$1.AC2 116.84,121.92 111.76,121.92 106.68,116.84 106.68,114.3 | 106.68,114.3 E1.7
LOAD_RWB  (via drill 0.81)
  Top 0.406: v64.77,50.8 73.66,50.8 76.2,48.26 v87.63,48.26
  Bottom 0.406: U$1.BF2 117.12,42.19 116.84,41.91 104.14,43.18 v87.63,48.26 | E11.2 E11.13 E11.5 E11.10 64.77,52.07 v64.77,50.8
LOAD_TAC  (via drill 0.81)
  Top 0.406: U$1.AA1 116.84,128.27 106.68,128.27 v104.14,125.73
  Bottom 0.406: E4.3 E4.11 26.67,124.46 92.71,124.46 95.25,125.73 v104.14,125.73
LOAD_TB  (via drill 0.81)
  Top 0.406: v95.25,6.35 36.83,6.35 30.48,12.7 30.48,22.86 27.94,25.4 13.97,25.4 7.62,31.75 7.62,40.64 20.32,52.07 v21.59,52.07
  Bottom 0.406: U$1.BT2 117.17,10.49 116.84,10.16 99.06,10.16 v95.25,6.35 | E12.11 E12.3 v21.59,52.07
LOAD_TBN
  Top 0.406: E8.11 26.67,95.25 68.58,95.25 73.66,100.33 105.41,100.33 110.49,105.41 116.84,105.41 U$1.AJ1
  Bottom 0.406: E8.3 E8.11
LOAD_TMA  (via drill 0.81)
  Top 0.406: v101.6,74.93 97.79,78.74 76.2,78.74 74.93,80.01 72.39,80.01 71.12,78.74 58.42,78.74 57.15,80.01 48.26,80.01 E7.3
  Bottom 0.406: U$1.AU2 116.84,77.47 109.22,77.47 106.68,74.93 v101.6,74.93 | E3.11 45.72,121.92 36.83,121.92 34.29,119.38 34.29,116.84 33.02,115.57 33.02,82.55 35.56,80.01 43.18,80.01 E7.3
LOAD_TMASU
  Top 0.406: E7.11 49.53,91.44 67.31,91.44 73.66,97.79 105.41,97.79 110.49,102.87 116.84,102.87 U$1.AK1
  Bottom 0.406: E7.11 E3.3
N$1  (via drill 0.81)
  Top 0.406: E9.1 91.44,48.26 88.9,45.72 76.2,45.72 73.66,48.26 62.23,48.26 v60.96,46.99 | v38.1,48.26 35.56,48.26 E15.9
  Bottom 0.406: v60.96,46.99 58.42,49.53 39.37,49.53 v38.1,48.26 | E15.10 E15.9
N$2  (via drill 0.81)
  Top 0.406: E9.12 90.17,72.39 77.47,72.39 74.93,69.85 69.85,69.85 67.31,72.39 35.56,72.39 v34.29,71.12
  Bottom 0.406: E15.13 E15.12 20.32,38.1 30.48,38.1 31.75,39.37 31.75,43.18 33.02,49.53 33.02,69.85 v34.29,71.12
N$3
  Bottom 0.406: E1.12 93.98,121.92 73.66,121.92 E2.12
N$4
  Top 0.406: E2.11 74.93,120.65 83.82,120.65 86.36,118.11 97.79,118.11 E1.11
N$5  (via drill 0.81)
  Top 0.406: v71.12,100.33 72.39,101.6 90.17,101.6 v92.71,104.14
  Bottom 0.406: E6.11 v71.12,100.33 | E5.11 99.06,97.79 v92.71,104.14
N$6  (via drill 0.81)
  Top 0.406: E6.12 76.2,95.25 v96.52,95.25
  Bottom 0.406: v96.52,95.25 E5.12
N$7
  Top 0.406: E11.11 49.53,67.31 67.31,67.31 E10.13
N$8
  Top 0.406: E11.8 58.42,63.5 73.66,63.5 E10.10
N$9
  Bottom 0.406: E17.12 52.07,26.67 64.77,26.67 E16.12
N$10
  Bottom 0.406: E17.11 49.53,22.86 60.96,22.86 64.77,19.05 71.12,19.05 E16.11
N$11
  Bottom 0.813: D4.A D5.C
N$12
  Bottom 0.406: E13.12 68.58,41.91 60.96,41.91 55.88,45.72 46.99,45.72 45.72,44.45 E14.12
N$13
  Bottom 0.406: E14.11 50.8,41.91 55.88,41.91 60.96,36.83 71.12,36.83 E13.11
N$14
  Bottom 0.813: D1.A D2.C
N$15
  Top 0.406: E15.6 30.48,27.94 39.37,27.94 E14.2
N$16
  Top 0.406: E10.4 72.39,57.15 46.99,57.15 E11.3
N$17
  Top 0.406: E11.6 57.15,62.23 62.23,62.23 E10.1
N$18
  Bottom 0.813: D2.A D3.C
N$19
  Bottom 0.813: D3.A D4.C
PHASE  (via drill 0.81)
  Top 0.406: E14.4 43.18,26.67 v29.21,26.67 E15.5
  Bottom 0.406: U$1.BS2 117.14,13.66 116.84,13.97 100.33,13.97 88.9,2.54 44.45,2.54 30.48,16.51 30.48,25.4 v29.21,26.67 | E15.5 E15.4
RWB2_H
  Top 0.406: E10.5 73.66,55.88 60.96,55.88 58.42,53.34 58.42,39.37 55.88,36.83 50.8,36.83 E14.3
  Bottom 0.406: E10.5 86.36,67.31 88.9,67.31 91.44,69.85 E5.1
RWB2_L
  Top 0.406: E10.6 74.93,54.61 60.96,54.61 59.69,53.34 59.69,38.1 55.88,34.29 53.34,34.29 E14.5
RWB3_H  (via drill 0.81)
  Top 0.406: v87.63,54.61 87.63,55.88 E10.9 74.93,62.23 72.39,62.23 E10.2
  Bottom 0.406: U$1.BD2 117.14,48.56 116.84,48.26 101.6,48.26 v87.63,54.61 | E1.13 91.44,116.84 87.63,116.84 85.09,114.3 85.09,87.63 83.82,86.36 83.82,68.58 82.55,67.31 80.01,67.31 E10.9
RWB_OUT
  Top 0.406: U$1.BV1 117.23,4.2 116.84,3.81 109.22,3.81 105.41,7.62 38.1,7.62 31.75,13.97 31.75,22.86 34.29,25.4 46.99,25.4 E14.6
SHIFT_RWB  (via drill 0.81)
  Top 0.406: v87.63,50.8 83.82,54.61 83.82,58.42 81.28,60.96 73.66,60.96 E10.3
  Bottom 0.406: U$1.BE2 117.17,45.39 116.84,45.72 102.87,45.72 v87.63,50.8 | E10.3 E10.11
TAC2_H  (via drill 0.81)
  Top 0.406: v59.69,102.87 26.67,102.87 v24.13,105.41 | E6.1 71.12,87.63 106.68,87.63 110.49,92.71 111.76,92.71 116.84,92.71 U$1.AN1
  Bottom 0.406: E6.1 59.69,88.9 v59.69,102.87 | v24.13,105.41 E4.5
TAC2_L  (via drill 0.81)
  Top 0.406: v26.67,107.95 29.21,105.41 68.58,105.41 69.85,104.14 77.47,104.14 78.74,105.41 93.98,105.41 96.52,102.87 v105.41,102.87
  Bottom 0.406: v26.67,107.95 E4.6 | U$1.AJ2 116.84,105.41 110.49,105.41 107.95,102.87 v105.41,102.87
TAC3_H  (via drill 0.81)
  Top 0.406: E4.9 30.48,115.57 38.1,114.3 43.18,114.3 45.72,116.84 66.04,116.84 E2.3 73.66,109.22 93.98,109.22 97.79,105.41 v104.14,105.41
  Bottom 0.406: U$1.AH2 116.84,109.22 110.49,109.22 106.68,105.41 v104.14,105.41
TAC3_L  (via drill 0.81)
  Top 0.406: U$1.AB1 116.84,124.46 v99.06,124.46
  Bottom 0.406: E4.8 34.29,123.19 92.71,123.19 95.25,124.46 v99.06,124.46
TAPE_BUS2
  Top 0.406: E8.2 20.32,86.36 39.37,86.36 E7.2
  Bottom 0.406: U$1.BV2 117.23,4.2 116.84,3.81 101.6,3.81 99.06,1.27 17.78,1.27 7.62,17.78 7.62,44.45 E12.2 | E12.2 E15.11 | E7.2 E7.12 | E4.2 7.62,102.87 7.62,87.63 | 7.62,87.63 11.43,87.63 E8.2 | E12.2 7.62,67.31 7.62,87.63
TAPE_BUS3  (via drill 0.81)
  Top 0.406: E4.12 20.32,120.65 30.48,120.65 31.75,119.38 v31.75,118.11 35.56,115.57 43.18,115.57 E3.12 | E15.8 31.75,36.83 v31.75,30.48
  Bottom 0.406: U$1.BR2 117.17,16.84 116.84,16.51 100.33,16.51 87.63,3.81 45.72,3.81 31.75,17.78 v31.75,30.48 | E15.8 29.21,44.45 31.75,50.8 31.75,68.58 | 31.75,68.58 31.75,93.98 | 31.75,93.98 22.86,93.98 E8.12 | 31.75,93.98 v31.75,118.11 | E3.2 43.18,115.57 E3.12 | E12.12 21.59,68.58 31.75,68.58
TB2_H  (via drill 0.81)
  Top 0.406: v64.77,46.99 64.77,15.24 E16.1 72.39,20.32 116.84,20.32 117.17,19.99 U$1.BP1 | E11.1 39.37,57.15 25.4,57.15 E12.5
  Bottom 0.406: E11.1 46.99,52.07 58.42,52.07 v64.77,46.99
TB2_L
  Top 0.406: E12.6 30.48,62.23 44.45,62.23 E11.4
TB3_H  (via drill 0.81)
  Top 0.406: U$1.BD1 116.84,48.26 97.79,48.26 86.36,36.83 71.12,36.83 E13.13 v68.58,46.99 | E12.9 29.21,63.5 50.8,63.5 E11.9
  Bottom 0.406: v68.58,46.99 68.58,49.53 E11.9
TB3_L
  Top 0.406: E12.8 30.48,67.31 44.45,67.31 E11.12
TBN2  (via drill 0.81)
  Top 0.406: U$1.AU1 116.84,77.47 109.22,77.47 105.41,73.66 97.79,73.66 95.25,76.2 40.64,76.2 38.1,78.74 v24.13,78.74
  Bottom 0.406: v24.13,78.74 E8.5
TBN3  (via drill 0.81)
  Top 0.406: E8.9 29.21,92.71 67.31,92.71 73.66,99.06 v104.14,99.06
  Bottom 0.406: v104.14,99.06 106.68,99.06 110.49,102.87 116.84,102.87 U$1.AK2
TMA2  (via drill 0.81)
  Top 0.406: v104.14,77.47 101.6,80.01 76.2,80.01 E6.4 71.12,80.01 60.96,80.01 57.15,83.82 52.07,83.82 E7.5
  Bottom 0.406: U$1.AT2 116.84,80.01 110.49,80.01 107.95,77.47 v104.14,77.47
TMA3
  Top 0.406: E3.9 54.61,118.11 77.47,118.11 E2.9 82.55,115.57 105.41,115.57 107.95,118.11 116.84,118.11 U$1.AD1
TMASU2
  Top 0.406: E7.9 62.23,81.28 69.85,81.28 E6.3 73.66,85.09 109.22,85.09 110.49,86.36 116.84,86.36 U$1.AR1
TMASU3  (via drill 0.81)
  Top 0.406: v66.04,106.68 68.58,106.68 69.85,105.41 77.47,105.41 78.74,106.68 93.98,106.68 96.52,104.14 105.41,104.14 110.49,109.22 116.84,109.22 U$1.AH1 | E3.5 54.61,115.57 62.23,115.57 E2.1
  Bottom 0.406: E2.1 v66.04,106.68
VCC  (via drill 0.81)
  Top 0.813: E1.14 v91.44,127 73.66,127 E2.14 63.5,121.92 43.18,121.92 E3.14 38.1,121.92 16.51,121.92 E4.14 | C17.1 E17.14 43.18,24.13 C16.1 | E9.4 93.98,63.5 88.9,63.5 C9.1 85.09,67.31 85.09,69.85 83.82,71.12 78.74,71.12 76.2,68.58 68.58,68.58 v66.04,71.12 41.91,71.12 v40.64,69.85 39.37,68.58 16.51,68.58 E12.14 | E6.14 C6.1 | E8.14 21.59,97.79 v36.83,97.79 59.69,97.79 v66.04,102.87 86.36,102.87 v87.63,104.14 | v48.26,43.18 44.45,43.18 E14.14 | C8.1 8.89,87.63 8.89,68.58 C12.1
  Bottom 0.813: R1.2 8.89,19.05 8.89,36.83 C15.1 E15.14 16.51,36.83 31.75,36.83 C14.1 | C17.1 36.83,22.86 36.83,36.83 C14.1 | E1.14 C1.1 | U$1.AA2 117.24,127.87 116.84,128.27 92.71,128.27 v91.44,127 | E4.14 C4.1 | E3.14 C3.1 34.29,114.3 34.29,100.33 v36.83,97.79 C7.1 E7.14 | E2.14 C2.1 | C16.1 E16.14 | E9.4 101.6,60.96 106.68,60.96 109.22,58.42 115.57,58.42 115.97,58.02 U$1.BA2 | E13.14 C13.1 54.61,44.45 49.53,44.45 v48.26,43.18 | C10.1 E10.14 v66.04,71.12 | v66.04,102.87 E6.14 | v87.63,104.14 E5.14 C5.1 | v40.64,69.85 E11.14 C11.1 34.29,63.5 C14.1 | C8.1 E8.14 | C14.1 E14.14 | E12.14 C12.1

### Text on the board
Bottom: LINC TAPE REGISTER M222B